# Altium schematic sheet 数字部分.SchDoc
size A4
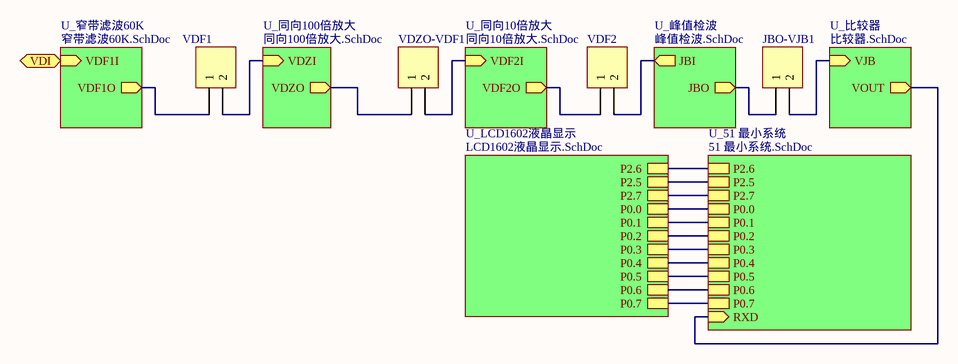
[diagram p0: 数字部分.SchDoc]

## Parts
JBO-VJB1  Header 2  [HDR1X2]  (value not drawn)
VDF1  Header 2  [HDR1X2]  (value not drawn)
VDF2  Header 2  [HDR1X2]  (value not drawn)
VDZO-VDF1  Header 2  [HDR1X2]  (value not drawn)

## Sub-sheets
U_51 最小系统 = 51 最小系统.SchDoc: P2.6, P2.5, P2.7, P0.0, P0.1, P0.2, P0.3, P0.4, P0.5, P0.6, P0.7, RXD (in)
U_LCD1602液晶显示 = LCD1602液晶显示.SchDoc: P2.6, P2.5, P2.7, P0.0, P0.1, P0.2, P0.3, P0.4, P0.5, P0.6, P0.7
U_同向10倍放大 = 同向10倍放大.SchDoc: VDF2I (in), VDF2O (out)
U_同向100倍放大 = 同向100倍放大.SchDoc: VDZI (in), VDZO (out)
U_峰值检波 = 峰值检波.SchDoc: JBI (out), JBO (out)
U_比较器 = 比较器.SchDoc: VJB (in), VOUT (out)
U_窄带滤波60K = 窄带滤波60K.SchDoc: VDF1I (in), VDF1O (out)

## Ports
VDI (in)

## Nets
VDI: port VDI, sheet U_窄带滤波60K/VDF1I
NetJBO-VJB1_1: JBO-VJB1.1 ; sheet U_峰值检波/JBO
NetJBO-VJB1_2: JBO-VJB1.2 ; sheet U_比较器/VJB
NetVDF1_1: VDF1.1 ; sheet U_窄带滤波60K/VDF1O
NetVDF1_2: VDF1.2 ; sheet U_同向100倍放大/VDZI
NetVDF2_1: VDF2.1 ; sheet U_同向10倍放大/VDF2O
NetVDF2_2: VDF2.2 ; sheet U_峰值检波/JBI
NetVDZO-VDF1_1: VDZO-VDF1.1 ; sheet U_同向100倍放大/VDZO
NetVDZO-VDF1_2: VDZO-VDF1.2 ; sheet U_同向10倍放大/VDF2I
(unnamed): sheet U_LCD1602液晶显示/P2.6, sheet U_51 最小系统/P2.6
(unnamed): sheet U_LCD1602液晶显示/P2.5, sheet U_51 最小系统/P2.5
(unnamed): sheet U_LCD1602液晶显示/P2.7, sheet U_51 最小系统/P2.7
(unnamed): sheet U_LCD1602液晶显示/P0.0, sheet U_51 最小系统/P0.0
(unnamed): sheet U_LCD1602液晶显示/P0.1, sheet U_51 最小系统/P0.1
(unnamed): sheet U_LCD1602液晶显示/P0.2, sheet U_51 最小系统/P0.2
(unnamed): sheet U_LCD1602液晶显示/P0.3, sheet U_51 最小系统/P0.3
(unnamed): sheet U_LCD1602液晶显示/P0.4, sheet U_51 最小系统/P0.4
(unnamed): sheet U_LCD1602液晶显示/P0.5, sheet U_51 最小系统/P0.5
(unnamed): sheet U_LCD1602液晶显示/P0.6, sheet U_51 最小系统/P0.6
(unnamed): sheet U_LCD1602液晶显示/P0.7, sheet U_51 最小系统/P0.7
(unnamed): sheet U_比较器/VOUT, sheet U_51 最小系统/RXD

## Notes on the sheet
- 标题
- 日期
- 红外数字模拟接收一体机
- 2015 5 29
- 作者
- 模电组
- 单位
- 电子技术协会

## Library data of the parts
JBO-VJB1 VDF1 VDF2 VDZO-VDF1 = Header 2: Header, 2-Pin; LatestRevisionDate: 17-Jul-2002; LatestRevisionNote: Re-released for DXP Platform.; Publisher: Altium Limited